# Altium project remoteV1.3.PrjPcb
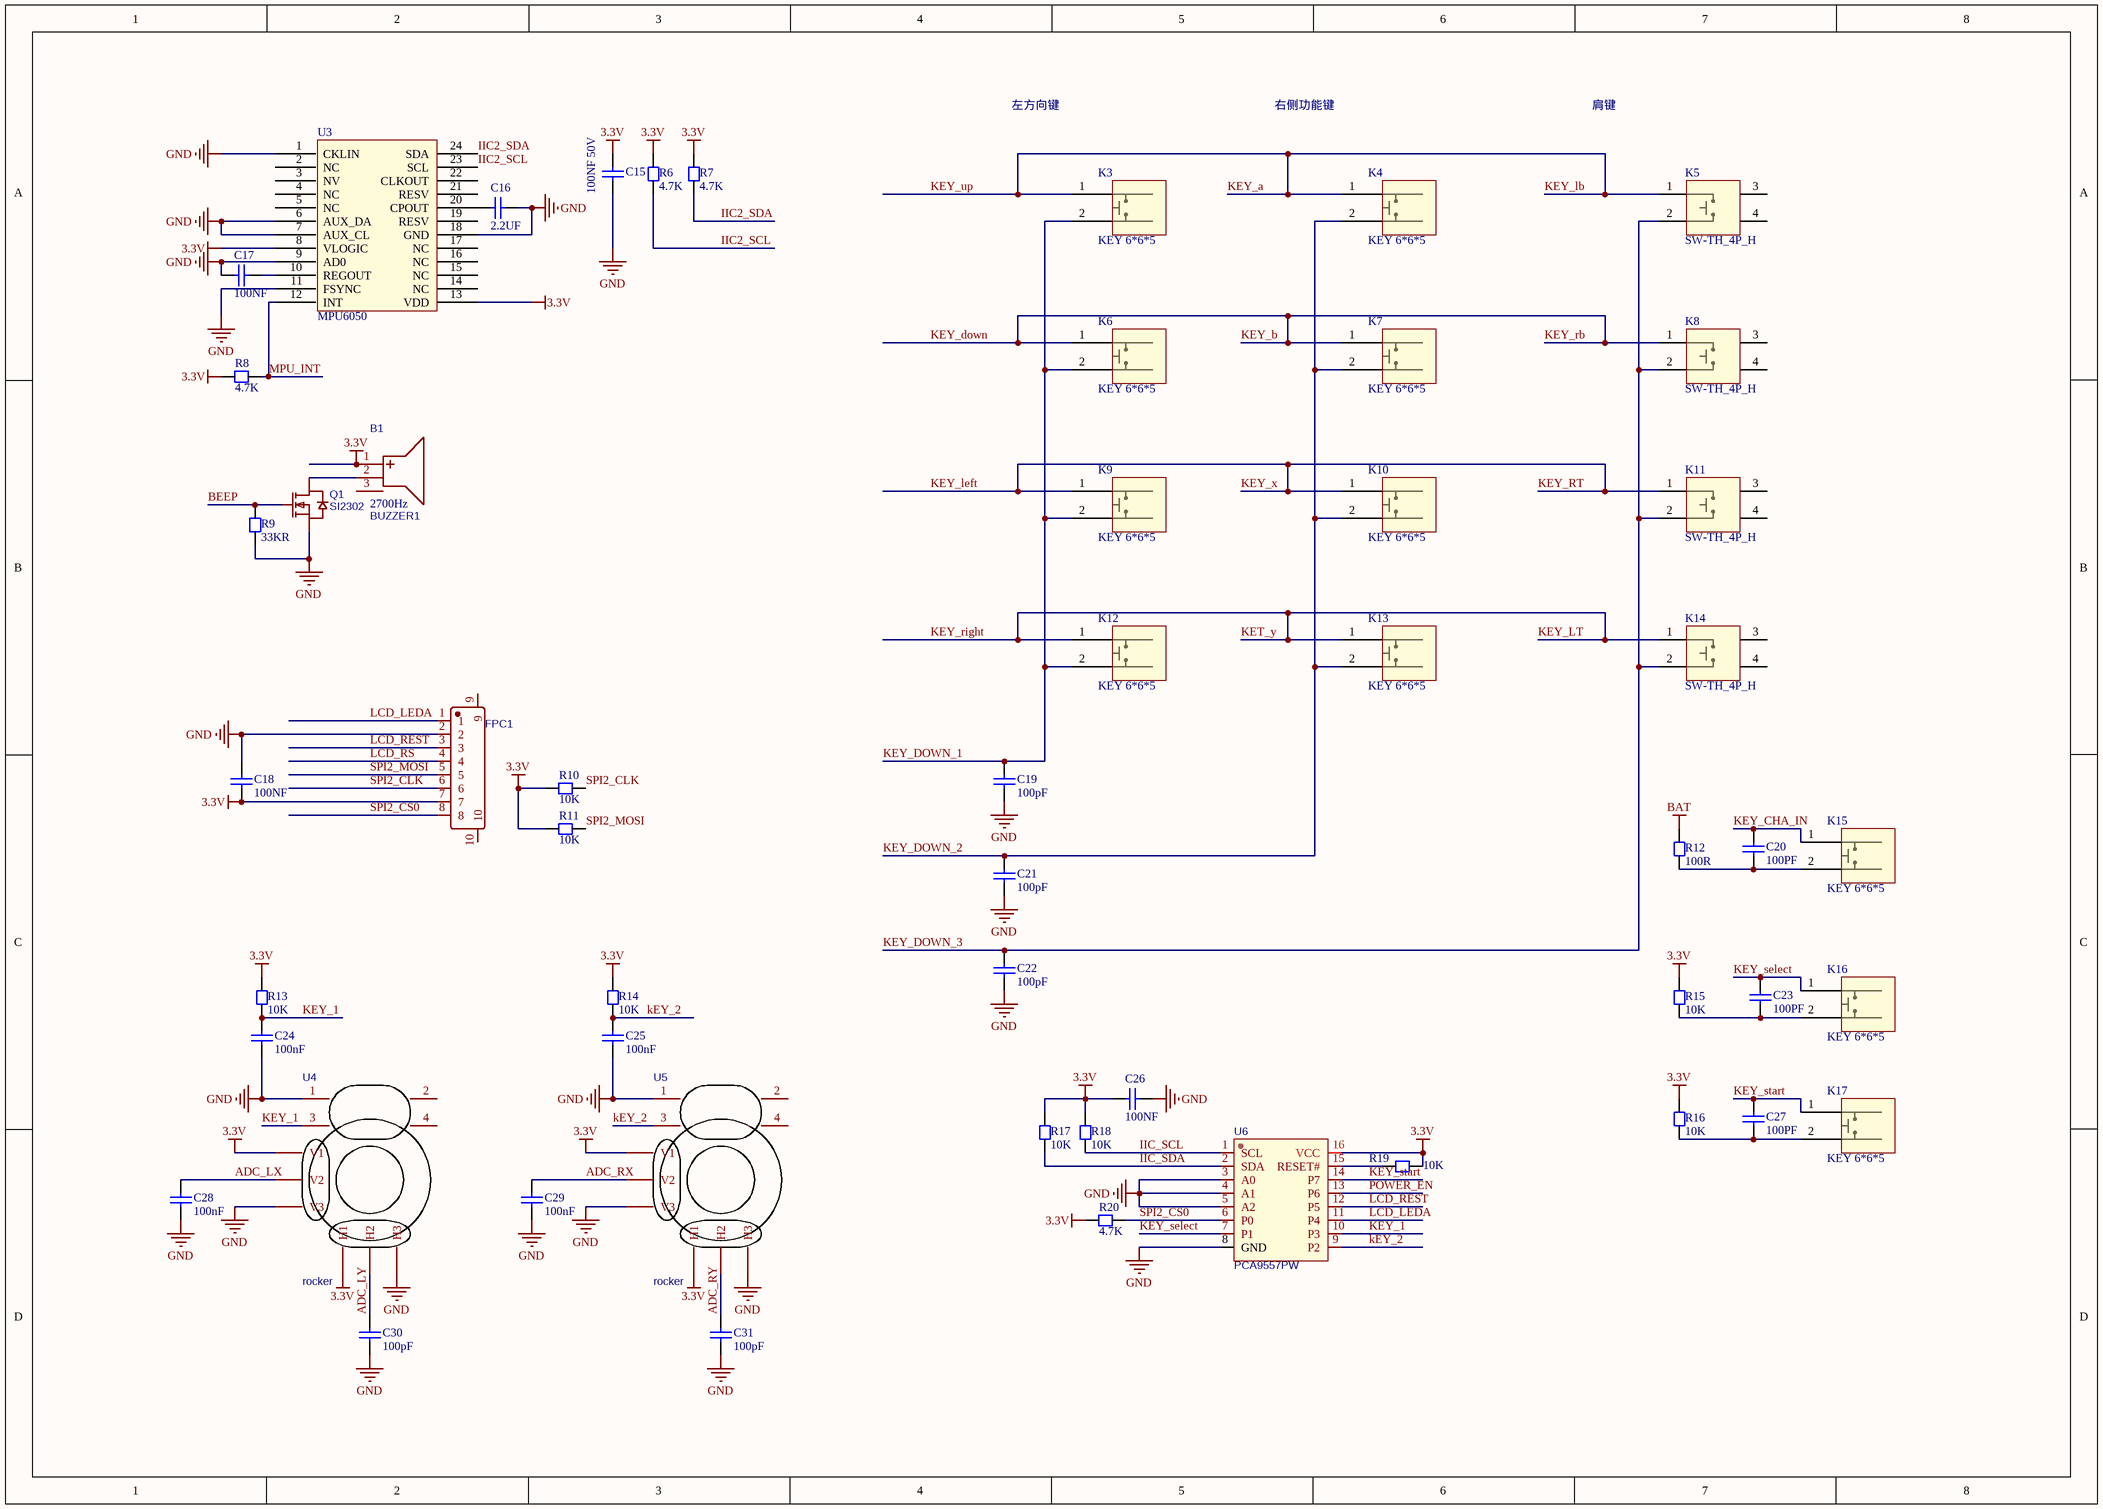
[diagram p0: Sheet1-control.SchDoc]
2 sheets, 110 parts. Net scope: global (net labels, ports and power ports of the same name join across sheets).
Board file: PCB.PcbDoc
Sheets:
  Sheet1-control.SchDoc
  Sheet2-USB.SchDoc

## Sheet Sheet1-control.SchDoc
size A3; SheetNumber: 2; SheetTotal: 5

### Parts
B1  BUZZER1  [BUZ-SMD_GSC7525RA]
C15  100NF 50V  [CC1608-0603]
C16  2.2UF  [CC1608-0603]
C17  100NF  [CC1608-0603]
C18  100NF  [CC1608-0603]
C19  100pF  [CC1608-0603]
C20  100PF  [CC1608-0603]
C21  100pF  [CC1608-0603]
C22  100pF  [CC1608-0603]
C23  100PF  [CC1608-0603]
C24  100nF  [CC1608-0603]
C25  100nF  [CC1608-0603]
C26  100NF  [CC1608-0603]
C27  100PF  [CC1608-0603]
C28  100nF  [CC1608-0603]
C29  100nF  [CC1608-0603]
C30  100pF  [CC1608-0603]
C31  100pF  [CC1608-0603]
FPC1  FFC 05 8P  [FFC-SMD_8P-P0.50]  (value not drawn)
K3  KEY 6*6*5  [KEY 6*6*5]
K4  KEY 6*6*5  [KEY 6*6*5]
K5  SW-TH_4P_H  [SW-TH_KH-6X6X7H-ZJ]
K6  KEY 6*6*5  [KEY 6*6*5]
K7  KEY 6*6*5  [KEY 6*6*5]
K8  SW-TH_4P_H  [SW-TH_KH-6X6X7H-ZJ]
K9  KEY 6*6*5  [KEY 6*6*5]
K10  KEY 6*6*5  [KEY 6*6*5]
K11  SW-TH_4P_H  [SW-TH_KH-6X6X7H-ZJ]
K12  KEY 6*6*5  [KEY 6*6*5]
K13  KEY 6*6*5  [KEY 6*6*5]
K14  SW-TH_4P_H  [SW-TH_KH-6X6X7H-ZJ]
K15  KEY 6*6*5  [KEY 6*6*5]
K16  KEY 6*6*5  [KEY 6*6*5]
K17  KEY 6*6*5  [KEY 6*6*5]
Q1  SI2302  [SOT-23]
R6  4.7K  [CR1608-0603]
R7  4.7K  [CR1608-0603]
R8  4.7K  [CR1608-0603]
R9  33KR  [CR1608-0603]
R10  10K  [CR1608-0603]
R11  10K  [CR1608-0603]
R12  100R  [CR1608-0603]
R13  10K  [CR1608-0603]
R14  10K  [CR1608-0603]
R15  10K  [CR1608-0603]
R16  10K  [CR1608-0603]
R17  10K  [CR1608-0603]
R18  10K  [CR1608-0603]
R19  10K  [CR1608-0603]
R20  4.7K  [CR1608-0603]
U3  MPU6050  [QFN24 - duplicate]
U4  rocker  [PCBComponent_1]
U5  rocker  [PCBComponent_1]
U6  PCA9557PW  [TSSOP-16]

### Nets
3.3V: B1.1(+) C15.2 C18.1 C26.2 FPC1.7 R6.1 R7.1 R8.1 R10.2 R11.2 R13.2 R14.2 R15.1 R16.1 R17.1 R18.1 R19.1 R20.1 U3.8(VLOGIC) U3.13(VDD) U4.5(V1) U4.8(H1) U5.5(V1) U5.8(H1) U6.16(VCC)
BAT: R12.1
GND: C15.1 C16.2 C17.1 C18.2 C19.1 C21.1 C22.1 C24.1 C25.1 C26.1 C28.1 C29.1 C30.1 C31.1 FPC1.2 Q1.2(S) R9.2 U3.1(CKLIN) U3.6(AUX_DA) U3.7(AUX_CL) U3.9(AD0) U3.11(FSYNC) U3.18(GND) U4.1 U4.7(V3) U4.10(H3) U5.1 U5.7(V3) U5.10(H3) U6.3(A0) U6.4(A1) U6.5(A2) U6.8(GND)
ADC_LX: C28.2 U4.6(V2)
ADC_LY: C30.2 U4.9(H2)
ADC_RX: C29.2 U5.6(V2)
ADC_RY: C31.2 U5.9(H2)
BEEP: Q1.1(G) R9.1
IIC2_SCL: R6.2 U3.23(SCL)
IIC2_SDA: R7.2 U3.24(SDA)
IIC_SCL: R18.2 U6.1(SCL)
IIC_SDA: R17.2 U6.2(SDA)
KET_y: K12.1 K13.1 K14.1  [also labelled KEY_LT, KEY_right]
KEY_1: C24.2 R13.1 U4.3 U6.10(P3)
kEY_2: C25.2 R14.1 U5.3 U6.9(P2)
KEY_a: K3.1 K4.1 K5.1  [also labelled KEY_lb, KEY_up]
KEY_b: K6.1 K7.1 K8.1  [also labelled KEY_down, KEY_rb]
KEY_CHA_IN: C20.1 K15.1
KEY_DOWN_1: C19.2 K3.2 K6.2 K9.2 K12.2
KEY_DOWN_2: C21.2 K4.2 K7.2 K10.2 K13.2
KEY_DOWN_3: C22.2 K5.2 K8.2 K11.2 K14.2
KEY_left: K9.1 K10.1 K11.1  [also labelled KEY_RT, KEY_x]
KEY_select: C23.1 K16.1 U6.7(P1)
KEY_start: C27.1 K17.1 U6.14(P7)
LCD_LEDA: FPC1.1 U6.11(P4)
LCD_REST: FPC1.3 U6.12(P5)
LCD_RS: FPC1.4
MPU_INT: R8.2 U3.12(INT)
POWER_EN: U6.13(P6)
SPI2_CLK: FPC1.6 R10.1
SPI2_CS0: FPC1.8 R20.2 U6.6(P0)
SPI2_MOSI: FPC1.5 R11.1
NetB1_2: B1.2(-) Q1.3(D)
NetC16_1: C16.1 U3.20(CPOUT)
NetC17_2: C17.2 U3.10(REGOUT)
NetC20_2: C20.2 K15.2 R12.2
NetC23_2: C23.2 K16.2 R15.2
NetC27_2: C27.2 K17.2 R16.2
NetR19_2: R19.2 U6.15(RESET#)

Not connected (* = marked no-connect by the designer): B1 3(EH); FPC1 9 10; K5 3 4; K8 3 4; K11 3 4; K14 3 4; U3 2(NC) 3(NV) 4(NC) 5(NC) 14(NC) 15(NC) 16(NC) 17(NC) 19(RESV) 21(RESV) 22(CLKOUT); U4 2 4; U5 2 4

### Notes on the sheet
- 左方向键
- 右侧功能键
- 肩键

### Library data of the parts
B1 = BUZZER1: 2700Hz; Manufacturer: INGHAi(赢海); Manufacturer Part: GSC7525RA-16R2700; Contributor: LCSC; nameAlias: Value; Supplier: LCSC; Supplier Part: C255313; spicePre: B; spiceSymbolName: GSC7525RA-16R2700
C15-C31 = Cap Chip 0603: 0603封装的电容; Published: 8-Jun-2000; Revision: July-2002: Re-released for DXP Platform.; Publisher: Altium Limited
FPC1 = FFC 05 8P: Manufacturer: TXGA(特思嘉); Manufacturer Part: FFC05001-08SBB124W5M-H; Contributor: LCSC; Supplier: LCSC; Supplier Part: C456420; JLCPCB Part Class: Extended Part; spicePre: F; spiceSymbolName: FFC05001-08SBB124W5M-H
K3 K4 K6 K7 K9 K10 K12 K13 K15-K17 = KEY 6*6*5: 无声轻触开关
K5 K8 K11 K14 = SW-TH_4P_H: 卧式轻触开关
Q1 = SI2302: N沟道 / 漏源电压(Vdss) 20V / 连续漏极电流(Id) 2.8A / 功率(Pd) 900mW / 导通电阻(RDS(on)@Vgs,Id) 55mΩ@4.5V,2.8A / 阈值电压(Vgs(th)@Id) 1.2V@250uA / 输入电容(Ciss@Vds) 260pF@10V; Manufacturer: TWGMC(台湾迪嘉); Manufacturer Part: SI2306; Contributor: LCSC; Supplier: LCSC; Supplier Part: C727154; JLCPCB Part Class: Extended Part; spicePre: Q; spiceSymbolName: SI2306_C727154
R6-R8 R10-R20 = Resistor Chip 0603: 0603封装电阻; Published: 8-Jun-2000; Revision: July-2002: Re-released for DXP Platform.; Publisher: Altium Limited
R9 = Chip resistor: 贴片电阻
U3 = MPU6050: 陀螺仪
U4 U5 = rocker: Manufacturer Part: 摇杆; Contributor: Alex_Ai; spicePre: U; spiceSymbolName: 摇杆_直插_圆半径13_10电气脚_4固定脚 COPY
U6 = PCA9557PW: TSSOP-16 8位I2C总线和SMBus I/O扩展器芯片; Manufacturer: TI(德州仪器); Contributor: LCSC; Supplier: LCSC; Supplier Part: C1542488; Manufacturer Part: PCA9557PW; JLCPCB Part Class: Extended Part; spicePre: U; spiceSymbolName: PCA9557PW

## Sheet Sheet2-USB.SchDoc
size A3; SheetNumber: 3; SheetTotal: 5
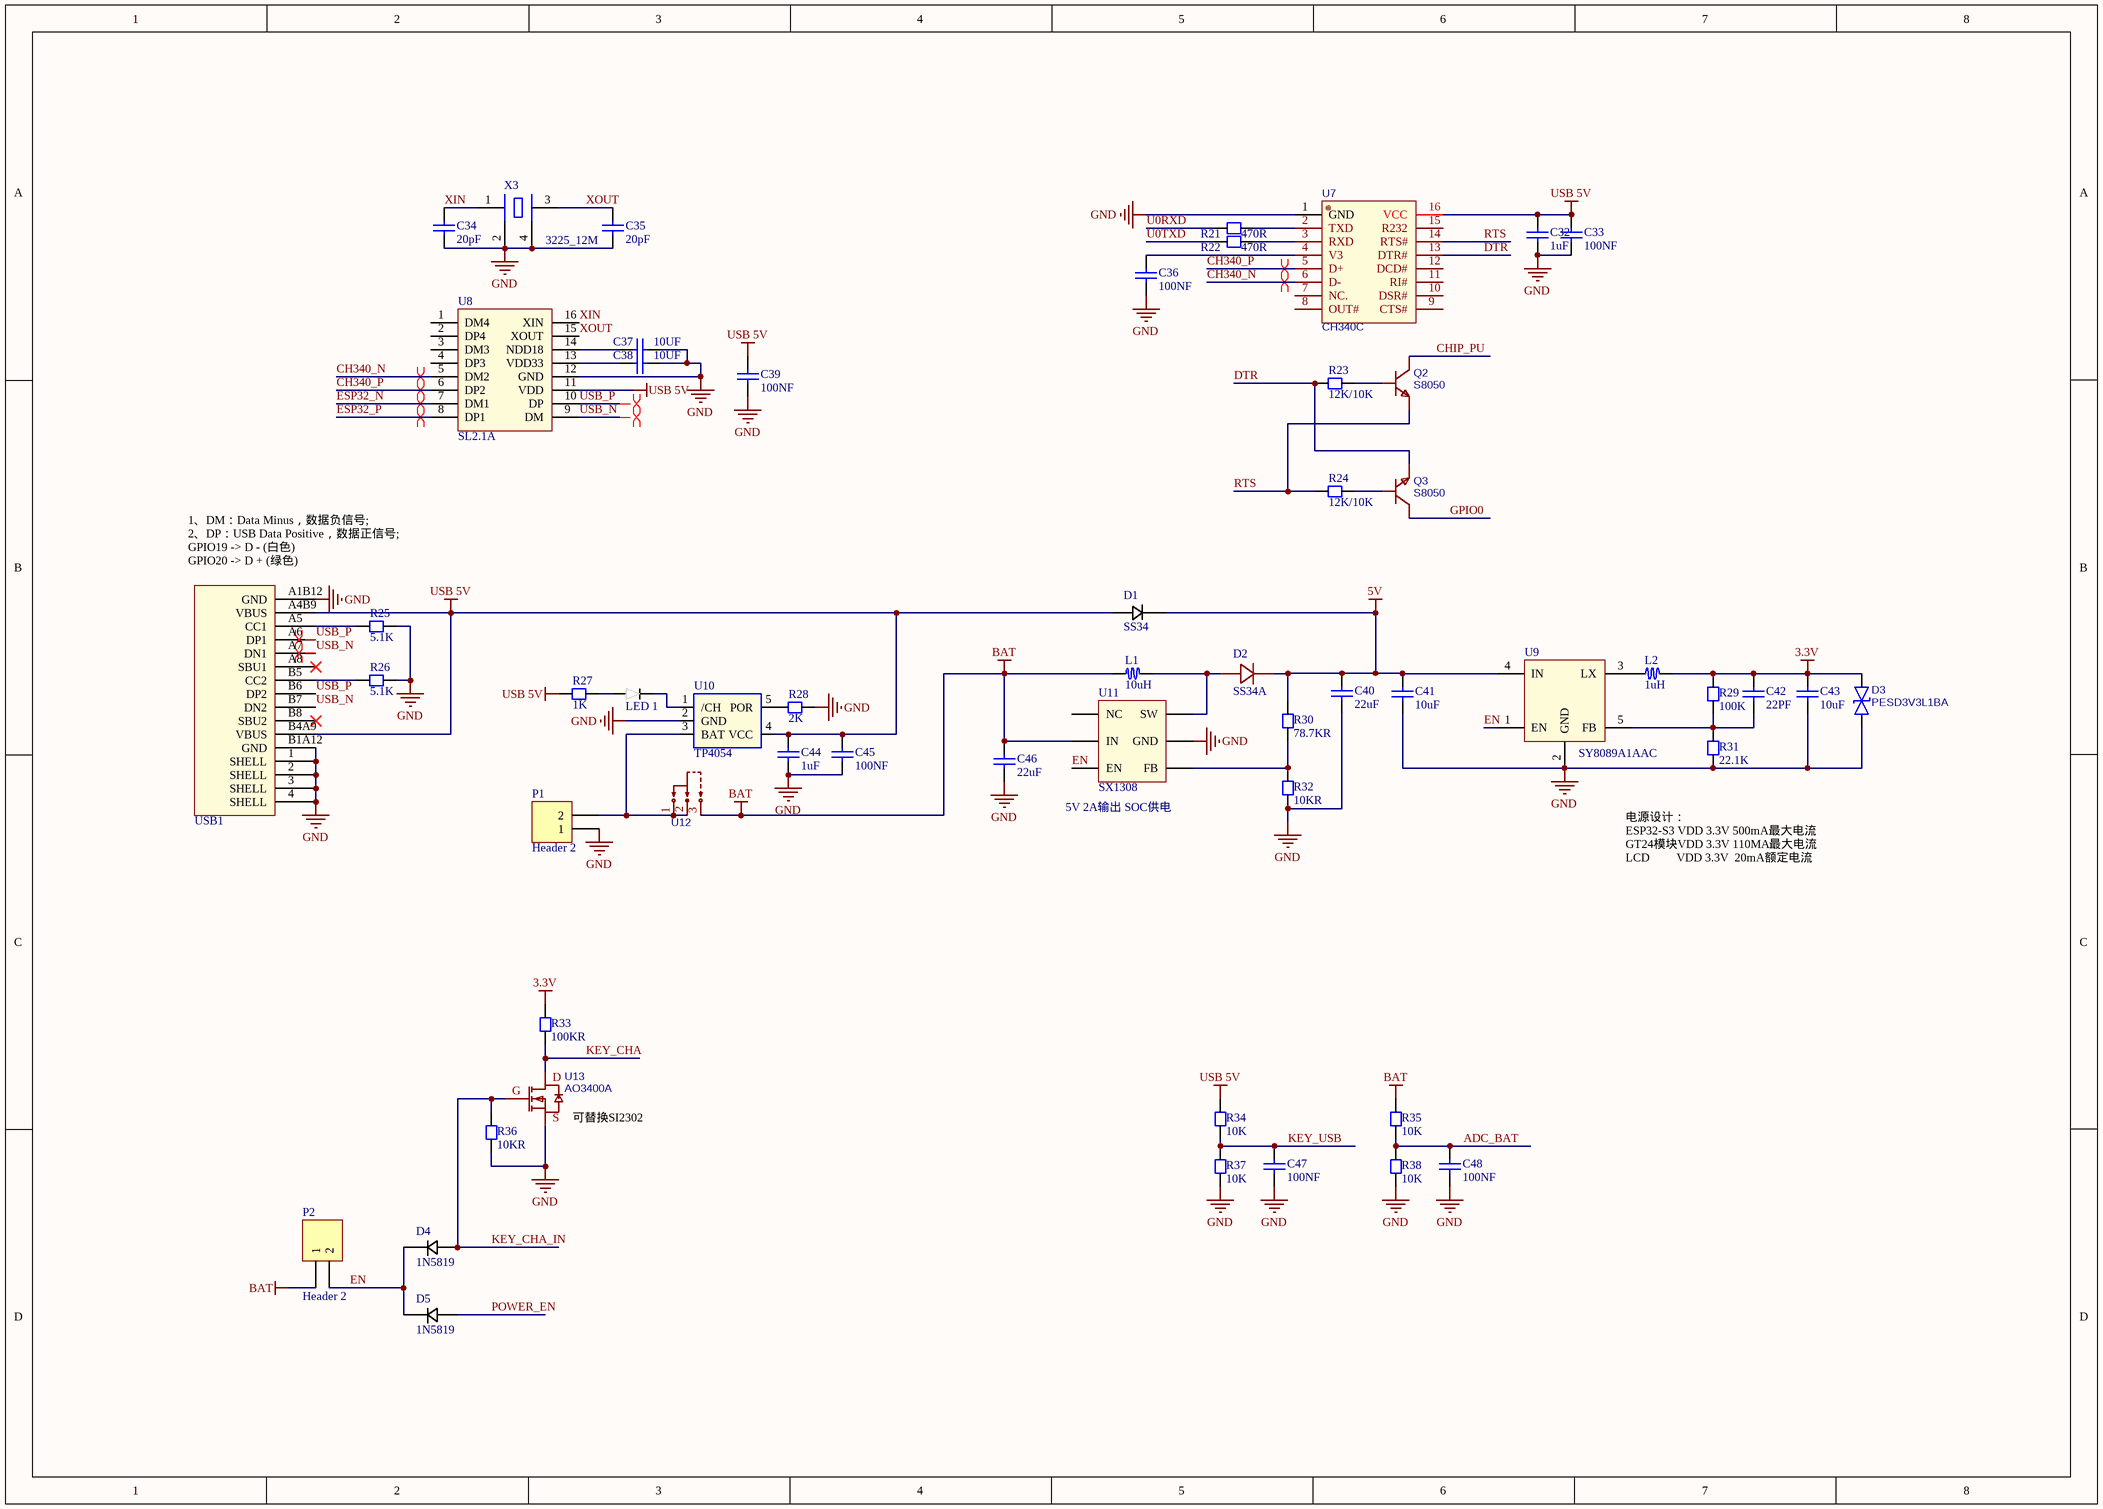
[diagram p1: Sheet2-USB.SchDoc]

### Parts
C32  1uF  [CC1608-0603]
C33  100NF  [CC1608-0603]
C34  20pF  [CC1608-0603]
C35  20pF  [CC1608-0603]
C36  100NF  [CC1608-0603]
C37  10UF  [CC1608-0603]
C38  10UF  [CC1608-0603]
C39  100NF  [CC1608-0603]
C40  22uF  [CC1608-0603]
C41  10uF  [CC1608-0603]
C42  22PF  [CC1608-0603]
C43  10uF  [CC1608-0603]
C44  1uF  [CC1608-0603]
C45  100NF  [CC1608-0603]
C46  22uF  [CC1608-0603]
C47  100NF  [CC1608-0603]
C48  100NF  [CC1608-0603]
D1  SS34  [DO-214 AA]
D2  SS34A  [DO-214 AA SMB]
D3  PESD3V3L1BA  [SOD-323]
D4  1N5819  [SOD-323_L1.8-W1.3-LS2.5-RD]
D5  1N5819  [SOD-323_L1.8-W1.3-LS2.5-RD]
L1  10uH  [Inductor-6045]
L2  1uH  [Inductor-4018]
LED_1  LED 0603  [LED 0603]  (value not drawn)
P1  Header 2  [HX2.54-2]
P2  Header 2  [HDR1X2]
Q2  S8050  [SOT-23]
Q3  S8050  [SOT-23]
R21  470R  [CR1608-0603]
R22  470R  [CR1608-0603]
R23  12K/10K  [CR1608-0603]
R24  12K/10K  [CR1608-0603]
R25  5.1K  [CR1608-0603]
R26  5.1K  [CR1608-0603]
R27  1K  [CR1608-0603]
R28  2K  [CR1608-0603]
R29  100K  [CR1608-0603]
R30  78.7KR  [CR1608-0603]
R31  22.1K  [CR1608-0603]
R32  10KR  [CR1608-0603]
R33  100KR  [CR1608-0603]
R34  10K  [CR1608-0603]
R35  10K  [CR1608-0603]
R36  10KR  [CR1608-0603]
R37  10K  [CR1608-0603]
R38  10K  [CR1608-0603]
U7  CH340C  [SOP-16]
U8  SL2.1A  [SOP-16]
U9  SY8089A1AAC  [SOT23-5]
U10  TP4054  [SOT23-5]
U11  SX1308  [SOT23-6]
U12  HX SS12D10G4  [SW-TH_3P-SS12D06]  (value not drawn)
U13  AO3400A  [SOT-23]
USB1  Tpye-c 16P  [TYPE-C 16P]  (value not drawn)
X3  3225_12M  [XTAL-3225]

### Nets
3.3V: C42.2 C43.2 D3.1 L2.2 R29.1 R33.2
5V: C40.1 C41.2 D1.1(K) D2.1(C) R30.2 U9.4(IN)
BAT: C46.2 L1.1 P2.1 R35.2 U11.5(IN) U12.3
GND: C32.1 C33.1 C34.1 C35.1 C36.1 C37.1 C38.1 C39.1 C40.2 C41.1 C43.1 C44.1 C45.1 C46.1 C47.1 C48.1 D3.2 P1.1 R25.1 R26.1 R28.2 R31.2 R32.1 R36.1 R37.1 R38.1 U7.1(GND) U8.12(GND) U9.2(GND) U10.2(GND) U11.2(GND) U13.2(S) USB1.1(SHELL) USB1.2(SHELL) USB1.3(SHELL) USB1.4(SHELL) USB1.A1B12(GND) USB1.B1A12(GND) X3.2(GND) X3.4(GND)
USB 5V: C32.2 C33.2 C39.2 C44.2 C45.2 D1.2(A) R27.1 R34.2 U7.16(VCC) U8.11(VDD) U10.4(VCC) USB1.A4B9(VBUS) USB1.B4A9(VBUS)
ADC_BAT: C48.2 R35.1 R38.2
CH340_N: U7.6(D-) U8.5(DM2)
CH340_P: U7.5(D+) U8.6(DP2)
CHIP_PU: Q2.3(C)
DTR: Q3.2(E) R23.1 U7.13(DTR#)
EN: D4.1 D5.1 P2.2 U9.1(EN) U11.4(EN)
ESP32_N: U8.7(DM1)
ESP32_P: U8.8(DP1)
GPIO0: Q3.3(C)
KEY_CHA: R33.1 U13.3(D)
KEY_CHA_IN: D4.2 R36.2 U13.1(G)
KEY_USB: C47.2 R34.1 R37.2
POWER_EN: D5.2
RTS: Q2.2(E) R24.1 U7.14(RTS#)
U0RXD: R21.2
U0TXD: R22.2
USB_N: U8.9(DM) USB1.A7(DN1) USB1.B7(DN2)
USB_P: U8.10(DP) USB1.A6(DP1) USB1.B6(DP2)
XIN: C34.2 U8.16(XIN) X3.1(OSC1)
XOUT: C35.2 U8.15(XOUT) X3.3(OSC2)
NetC36_2: C36.2 U7.4(V3)
NetC37_2: C37.2 U8.14(NDD18)
NetC38_2: C38.2 U8.13(VDD33)
NetC42_1: C42.1 R29.2 R31.1 U9.5(FB)
NetD2_2: D2.2(A) L1.2 U11.1(SW)
NetL2_1: L2.1 U9.3(LX)
NetLED_1_1: LED_1.1 R27.2
NetLED_1_2: LED_1.2 U10.1(/CH)
NetP1_2: P1.2 U10.3(BAT) U12.1 U12.2
NetQ2_1: Q2.1(B) R23.2
NetQ3_1: Q3.1(B) R24.2
NetR21_1: R21.1 U7.2(TXD)
NetR22_1: R22.1 U7.3(RXD)
NetR25_2: R25.2 USB1.A5(CC1)
NetR26_2: R26.2 USB1.B5(CC2)
NetR28_1: R28.1 U10.5(POR)
NetR30_1: R30.1 R32.2 U11.3(FB)

Not connected (* = marked no-connect by the designer): U7 7(NC.) 8(OUT#) 9(CTS#) 10(DSR#) 11(RI#) 12(DCD#) 15(R232); U8 1(DM4) 2(DP4) 3(DM3) 4(DP3); U11 6(NC); USB1 A8(SBU1)* B8(SBU2)*

### Layout directives
differential pair: CH340_N, CH340_P, ESP32_N, ESP32_P, USB_N, USB_P

### Notes on the sheet
- (near USB1) 1、DM：Data Minus，数据负信号;
  2、DP：USB Data Positive，数据正信号;
  GPIO19 -> D - (白色)
  GPIO20 -> D + (绿色)
- (near U11) 5V 2A输出 SOC供电
- 电源设计：
  ESP32-S3 VDD 3.3V 500mA最大电流
  GT24模块VDD 3.3V 110MA最大电流
  LCD         VDD 3.3V  20mA额定电流
- (near U13) 可替换SI2302

### Library data of the parts
C32-C39 C41-C48 = Cap Chip 0603: 0603封装的电容; Published: 8-Jun-2000; Revision: July-2002: Re-released for DXP Platform.; Publisher: Altium Limited
C40 = Chip capacitor: 贴片电容
D1 = SS34: 肖特基二极管
D2 = SS34A: 大电流肖特基二极管，5A/40V
D3 = PESD3V3L1BA: SOD-323 3.3V 双向ESD防静电二极管保护芯片; Manufacturer: MDD; Manufacturer Part: SMAJ6.5CA; Supplier: LCSC; Supplier Part: C110041; JLCPCB Part Class: Extended Part; spicePre: D; spiceSymbolName: SMAJ6.5CA-C110041
D4 D5 = 1N5819: 肖特基二极管
L1 = Inductor-6045: 6045封装 线绕SMD功率电感
L2 = Inductor-4018: 贴片电感 1206封装
P1 P2 = Header 2: Header, 2-Pin; LatestRevisionDate: 17-Jul-2002; LatestRevisionNote: Re-released for DXP Platform.; Publisher: Altium Limited
Q2 Q3 = S8050: Manufacturer: SALLTECH(萨瑞); Contributor: lcsc; Supplier: LCSC; Supplier Part: C3027096; Manufacturer Part: S8050; spicePre: Q; spiceSymbolName: S8050_C3027096
R21-R29 R31 R34 R35 R37 R38 = Resistor Chip 0603: 0603封装电阻; Published: 8-Jun-2000; Revision: July-2002: Re-released for DXP Platform.; Publisher: Altium Limited
R30 R32 R33 R36 = Chip resistor: 贴片电阻
U7 = CH340C: Manufacturer: WCH(南京沁恒); Supplier: LCSC; Manufacturer Part: CH340C; Supplier Part: C84681; JLCPCB Part Class: Extended Part; spicePre: U; spiceSymbolName: CH340C
U8 = SL2.1A: USB HUB 四拓展
U9 = SY8089A1AAC: SY8089A1是一种高效率的1.5MHz同步降压DC/DC稳压器，能够提供高达输出电流2A。它可以在2.5V到5.5V的宽输入电压范围内工作，集成了主开关和同步开关，具有极低的RDS(ON)，最大限度地减少了导通损耗。 / 输出电压纹波小，外接电感小，电容器尺寸小 / 1.5MHz开关频率。
U10 = TP4054: 迷你充电IC SOT-23-5
U11 = SX1308: SOT23-6 升压芯片
U12 = SW-TH_3P-SS12D06: BOM_Manufacturer: hanxia(韩下); Contributor: lcsc; BOM_Supplier: LCSC; BOM_Supplier Part: C5149841; BOM_Manufacturer Part: HX SS12D10G4; link: https://atta.szlcsc.com/upload/public/pdf/source/20220907/2020D7183ED16DD6E2B9F5A13FB144CF.pdf; BOM_JLCPCB Part Class: Extended Part; spicePre: U; spiceSymbolName: HX SS12D10G4
U13 = AO3400A: UMW AO3400A SOT-23 30V/5.8A N沟道 MOS(场效应管)芯片; Manufacturer: ElecSuper(静芯微）; Manufacturer Part: AO3401A; Contributor: lcsc; Supplier: LCSC; Supplier Part: C5224202; JLCPCB Part Class: Extended Part; link: https://so.szlcsc.com/global.html?k=C5224202&ref=editor; spicePre: U; spiceSymbolName: AO3401A_C5224202
USB1 = Tpye-c 16P: 16P 封装的TYPE -c接口 4固定插脚 双向
X3 = XTAL 3225: 3225封装的晶振

## Nets that join several sheets
3.3V: Sheet1-control (25 pins), Sheet2-USB (6 pins)
BAT: Sheet1-control (R12.1), Sheet2-USB (6 pins)
GND: Sheet1-control (33 pins), Sheet2-USB (40 pins)
KEY_CHA_IN: Sheet1-control (C20.1 K15.1), Sheet2-USB (D4.2 R36.2 U13.1)
POWER_EN: Sheet1-control (U6.13), Sheet2-USB (D5.2)